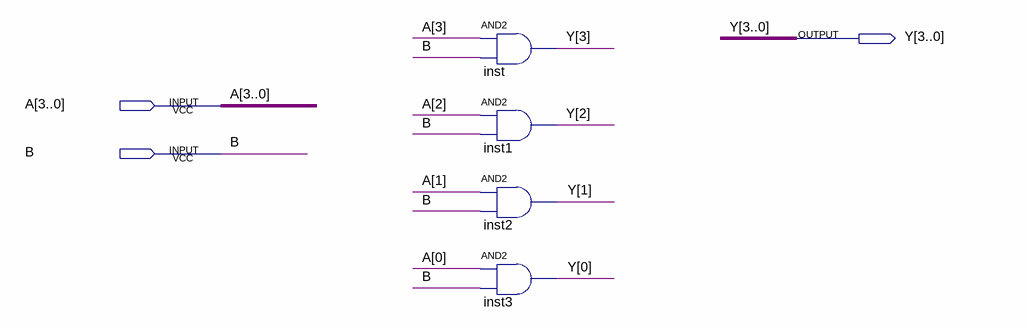
[diagram p0: schematic sheet]
// Quartus schematic Nhan1Bit.bdf as structural Verilog: 4 symbols, 3 pins
module Nhan1Bit (
  input  [3:0] A,
  input  B,
  output [3:0] Y
);

  and inst (Y[3], A[3], B);
  and inst1 (Y[2], A[2], B);
  and inst2 (Y[1], A[1], B);
  and inst3 (Y[0], A[0], B);
endmodule
